# EAGLE design geiger (EAGLE 6.4)
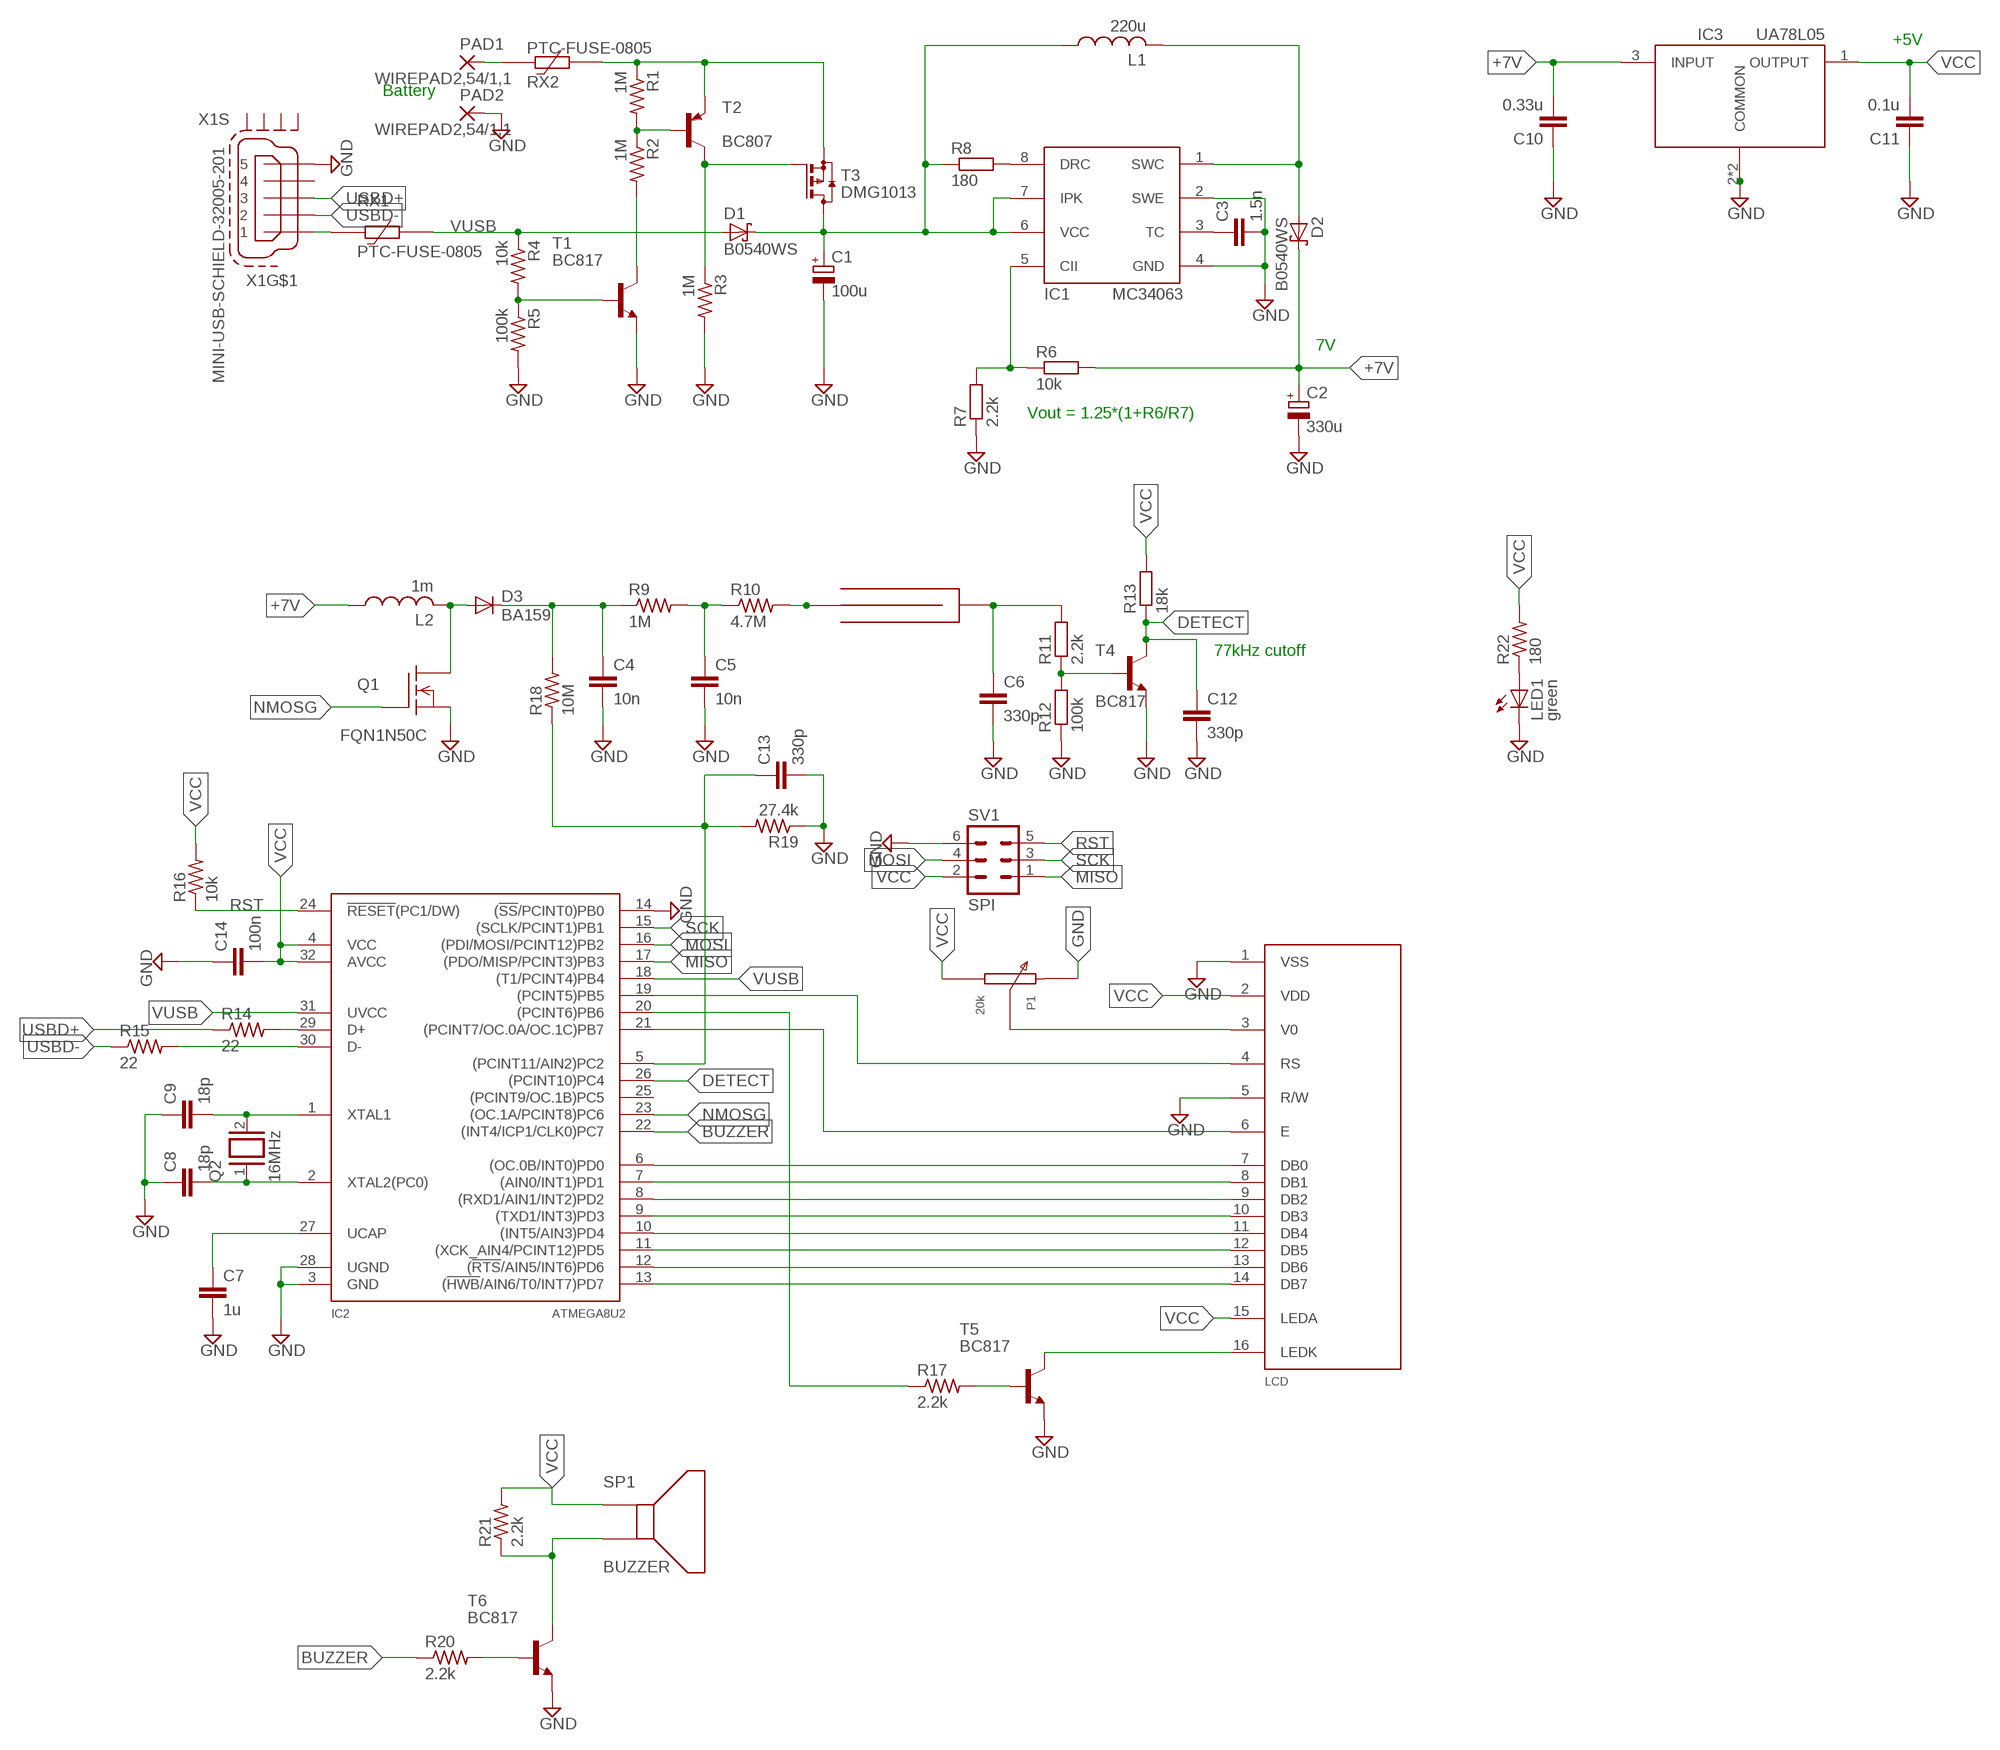
[diagram p0: schematic, sheet 1]

## Parts
C1  100u  CPOL-EUE2.5-6  [E2,5-6]
C2  330u  CPOL-EUE2.5-6  [E2,5-6]
C3  1.5n  C-EUC0603  [C0603]
C4  10n  C-EU050-024X044  [C050-024X044]
C5  10n  C-EU050-024X044  [C050-024X044]
C6  330p  C-EUC0603  [C0603]
C7  1u  C-EUC0603  [C0603]
C8  18p  C-EUC0603  [C0603]
C9  18p  C-EUC0603  [C0603]
C10  0.33u  C-EUC0603  [C0603]
C11  0.1u  C-EUC0603  [C0603]
C12  330p  C-EUC0603  [C0603]
C13  330p  C-EUC0603  [C0603]
C14  100n  C-EUC0603  [C0603]
D1  B0540WS  [SOD323-R]
D2  B0540WS  [SOD323-R]
D3  BA159  [DO41-10]
G1  CI-22BG/SI-3BG  [FUSE102074]
IC1  MC34063  [SO8]
IC2  ATMEGA8U2  [TQFP32-08]
IC3  UA78L05  [SOT89]
L1  220u  BOURNS8012  [L8012]
L2  1m  BOURNS8012  [L8012]
LCD  TAYDA-LCD  [LCD-PINOUT]
LED1  green  LEDCHIP-LED0603  [CHIP-LED0603]
P1  20k  TRIMPOT  [TRIMPOT]
PAD1  WIREPAD2,54/1,1  [2,54/1,1]
PAD2  WIREPAD2,54/1,1  [2,54/1,1]
Q1  FQN1N50C  [TO92]
Q2  16MHz  XTAL/S  [QS]
R1  1M  R-US_R0603  [R0603]
R2  1M  R-US_R0603  [R0603]
R3  1M  R-US_R0603  [R0603]
R4  10k  R-US_R0603  [R0603]
R5  100k  R-US_R0603  [R0603]
R6  10k  R-EU_R0603  [R0603]
R7  2.2k  R-EU_R0603  [R0603]
R8  180  R-EU_R0603  [R0603]
R9  1M  R-US_0207/7  [0207/7]
R10  4.7M  R-US_0207/7  [0207/7]
R11  2.2k  R-EU_R0603  [R0603]
R12  100k  R-EU_R0603  [R0603]
R13  18k  R-EU_R0603  [R0603]
R14  22  R-US_R0603  [R0603]
R15  22  R-US_R0603  [R0603]
R16  10k  R-US_R0603  [R0603]
R17  2.2k  R-US_R0603  [R0603]
R18  10M  R-US_0207/7  [0207/7]
R19  27.4k  R-US_R0603  [R0603]
R20  2.2k  R-US_R0603  [R0603]
R21  2.2k  R-US_R0603  [R0603]
R22  180  R-US_R0603  [R0603]
RX1  PTC-FUSE-0805  [R0805]
RX2  PTC-FUSE-0805  [R0805]
SP1  BUZZER  [BUZZER]
SV1  SPI  MA03-2  [MA03-2]
T1  BC817  BC817-40-NPN-SOT23-BEC  [SOT23-BEC]
T2  BC807  BC807-40-PNP-SOT23-BEC  [SOT23-BEC]
T3  DMG1013  [SOT323]
T4  BC817  BC817-40-NPN-SOT23-BEC  [SOT23-BEC]
T5  BC817  BC817-40-NPN-SOT23-BEC  [SOT23-BEC]
T6  BC817  BC817-40-NPN-SOT23-BEC  [SOT23-BEC]
X1  MINI-USB-SCHIELD-32005-201  [32005-201]

## Nets
+7V: C2.+ C10.2 D2.C IC3.3(INPUT) L2.1 R6.2
BUZZER: IC2.22((INT4/ICP1/CLK0)PC7) R20.1
DETECT: C12.1 IC2.26((PCINT10)PC4) R13.1 T4.C
GND: C1.- C2.- C3.2 C4.2 C5.2 C6.2 C7.2 C8.1 C9.1 C10.1 C11.1 C12.2 C13.2 C14.1 IC1.2(SWE) IC1.4(GND) IC2.3(GND) IC2.14((!SS!/PCINT0)PB0) IC2.28(UGND) IC3.2(COMMON) IC3.2@1(COMMON) LCD.1(VSS) LCD.5(R/W) LED1.C P1.P$2 PAD2.1(P) Q1.1(S) R3.2 R5.2 R7.1 R12.1 R19.1 SV1.6 T1.E T4.E T5.E T6.E X1.5
MISO: IC2.17((PDO/MISP/PCINT3)PB3) SV1.1
MOSI: IC2.16((PDI/MOSI/PCINT12)PB2) SV1.4
N$1: R1.2 R2.1 T2.B
N$2: R2.2 T1.C
N$3: R3.1 T2.C T3.2(G)
N$4: R1.1 RX2.2 T2.E T3.3(S)
N$5: R4.2 R5.1 T1.B
N$6: D3.A L2.2 Q1.2(D)
N$7: C1.+ D1.C IC1.6(VCC) IC1.7(IPK) L1.1 R8.1 T3.1(D)
N$8: IC1.5(CII) R6.1 R7.2
N$9: C4.1 D3.C R9.1 R18.2
N$10: C5.1 R9.2 R10.1
N$11: IC1.8(DRC) R8.2
N$12: D2.A IC1.1(SWC) L1.2
N$13: G1.A1(A) G1.A2(A) R10.2
N$14: C3.1 IC1.3(TC)
N$15: R11.1 R12.2 T4.B
N$16: C6.1 G1.C1(C) G1.C2(C) G1.C3(C) G1.C4(C) R11.2
N$17: IC2.29(D+) R14.2
N$18: IC2.30(D-) R15.2
N$19: R21.1 SP1.P$2 T6.C
N$20: RX1.1 X1.1
N$21: C7.1 IC2.27(UCAP)
N$22: IC2.6((OC.0B/INT0)PD0) LCD.7(DB0)
N$23: C9.2 IC2.1(XTAL1) Q2.2
N$24: C8.2 IC2.2(XTAL2(PC0)) Q2.1
N$25: IC2.7((AIN0/INT1)PD1) LCD.8(DB1)
N$26: IC2.8((RXD1/AIN1/INT2)PD2) LCD.9(DB2)
N$27: IC2.9((TXD1/INT3)PD3) LCD.10(DB3)
N$28: IC2.10((INT5/AIN3)PD4) LCD.11(DB4)
N$29: IC2.11((XCK_AIN4/PCINT12)PD5) LCD.12(DB5)
N$30: IC2.12((!RTS!/AIN5/INT6)PD6) LCD.13(DB6)
N$31: IC2.13((!HWB!/AIN6/T0/INT7)PD7) LCD.14(DB7)
N$32: IC2.21((PCINT7/OC.0A/OC.1C)PB7) LCD.6(E)
N$33: PAD1.1(P) RX2.1
N$34: IC2.19((PCINT5)PB5) LCD.4(RS)
N$35: LCD.3(V0) P1.P$1(WIPER)
N$36: LCD.16(LEDK) T5.C
N$37: R17.2 T5.B
N$38: IC2.20((PCINT6)PB6) R17.1
N$39: C13.1 IC2.5((PCINT11/AIN2)PC2) R18.1 R19.2
N$40: R20.2 T6.B
N$41: LED1.A R22.1
NMOSG: IC2.23((OC.1A/PCINT8)PC6) Q1.3(G)
RST: IC2.24(!RESET!(PC1/DW)) R16.1 SV1.5
SCK: IC2.15((SCLK/PCINT1)PB1) SV1.3
USBD+: R14.1 X1.3
USBD-: R15.1 X1.2
VCC: C11.2 C14.2 IC2.4(VCC) IC2.32(AVCC) IC3.1(OUTPUT) LCD.2(VDD) LCD.15(LEDA) P1.P$3 R13.2 R16.2 R21.2 R22.2 SP1.P$1 SV1.2
VUSB: D1.A IC2.18((T1/PCINT4)PB4) IC2.31(UVCC) R4.1 RX1.2
Unconnected: IC2.25((PCINT9/OC.1B)PC5) X1.4 X1.M1(S:S1) X1.M2(S:S2) X1.M3(S:S3) X1.M4(S:S4)

## Notes on the sheet
- +5V
- Battery
- 7V
- Vout = 1.25*(1+R6/R7)
- 77kHz cutoff

## Library data of the parts
C1 C2 = rcl:CPOL-EU: POLARIZED CAPACITOR, European symbol
C3-C14 = rcl:C-EU: CAPACITOR, European symbol
D1 D2 = hf:B0540WS
D3 = hf:BA159: DIODE fast soft-recovery controlled avalanche rectifier
G1 = hf:CI-22BG/SI-3BG
IC1 = hf:MC34063
IC2 = hf:ATMEGA8U2: Atmel ATMEGA8U2 microprocessor in TQFP32 package
IC3 = hf:UA78L05
L1 L2 = hf:BOURNS8012
LCD = hf:TAYDA-LCD
LED1 = led:LED: LED OSRAM: - CHIPLED LG R971, LG N971, LY N971, LG Q971, LY Q971, LO R971, LY R971 LH N974, LH R974 LS Q976, LO Q976, LY Q976 LO Q996 - Hyper CHIPLED LW Q18S LB Q993, LB Q99A, LB R99A - SideLED LS A670, LO A670, LY A670, LG A670, LP A670 LB A673, LV A673, LT A673, LW A673 LH A674 LY A675 LS A676, LA A676, LO A676, LY A676, LW A676 LS A679, LY A679, LG A679 - Hyper Micro SIDELED® LS Y876, LA Y876, LO Y876, LY Y876 LT Y87S - SmartLED LW L88C, LW L88S LB L89C, LB L89S, LG L890 LS L89K, LO L89K, LY L89K LS L896, LA L896, LO L896, LY L896 - TOPLED LS T670, LO T670, LY T670, LG T670, LP T670 LSG T670, LSP T670, LSY T670, LOP T670, LYG T670 LG T671, LOG T671, LSG T671 LB T673, LV T673, LT T673, LW T673 LH T674 LS T676, LA T676, LO T676, LY T676, LB T676, LH T676, LSB T676, LW T676 LB T67C, LV T67C, LT T67C, LS T67K, LO T67K, LY T67K, LW E67C LS E67B, LA E67B, LO E67B, LY E67B, LB E67C, LV E67C, LT E67C LW T67C LS T679, LY T679, LG T679 LS T770, LO T770, LY T770, LG T770, LP T770 LB T773, LV T773, LT T773, LW T773 LH T774 LS E675, LA E675, LY E675, LS T675 LS T776, LA T776, LO T776, LY T776, LB T776 LHGB T686 LT T68C, LB T68C - Hyper Mini TOPLED® LB M676 - Mini TOPLED Santana® LG M470 LS M47K, LO M47K, LY M47K Source: http://www.osram.convergy.de LUXEON: - LUMILED® LXK2-PW12-R00, LXK2-PW12-S00, LXK2-PW14-U00, LXK2-PW14-V00 LXK2-PM12-R00, LXK2-PM12-S00, LXK2-PM14-U00 LXK2-PE12-Q00, LXK2-PE12-R00, LXK2-PE12-S00, LXK2-PE14-T00, LXK2-PE14-U00 LXK2-PB12-K00, LXK2-PB12-L00, LXK2-PB12-M00, LXK2-PB14-N00, LXK2-PB14-P00, LXK2-PB14-Q00 LXK2-PR12-L00, LXK2-PR12-M00, LXK2-PR14-Q00, LXK2-PR14-R00 LXK2-PD12-Q00, LXK2-PD12-R00, LXK2-PD12-S00 LXK2-PH12-R00, LXK2-PH12-S00 LXK2-PL12-P00, LXK2-PL12-Q00, LXK2-PL12-R00 Source: www.luxeon.com KINGBRIGHT: KA-3528ASYC Source: www.kingbright.com
P1 = hf:TRIMPOT
PAD1 PAD2 = wirepad:WIREPAD: Wire PAD connect wire on PCB
Q1 = hf:FQN1N50C: N-Channel Enhancement MOSFET not checked
Q2 = hf:XTAL/S: CRYSTAL
R1-R5 R14-R17 R19-R22 = resistor:R-US_: RESISTOR, American symbol
R6-R8 R11-R13 = resistor:R-EU_: RESISTOR, European symbol
R9 R10 R18 = rcl:R-US_: RESISTOR, American symbol
RX1 RX2 = hf:PTC-FUSE-0805: PTC Dummy
SP1 = hf:BUZZER
SV1 = con-lstb:MA03-2: PIN HEADER; OC_FARNELL: unknown; OC_NEWARK: unknown
T1 T4-T6 = transistor:*-NPN-: NPN Transistror BF959 corrected 2008.03.06
T2 = transistor:*-PNP-: PNP Transistror
T3 = hf:DMG1013
X1 = hf:MINI-USB-SCHIELD-: MINI USB-B Conector Source: www.cypressindustries.com; OC_FARNELL: unknown; OC_NEWARK: unknown

## Board
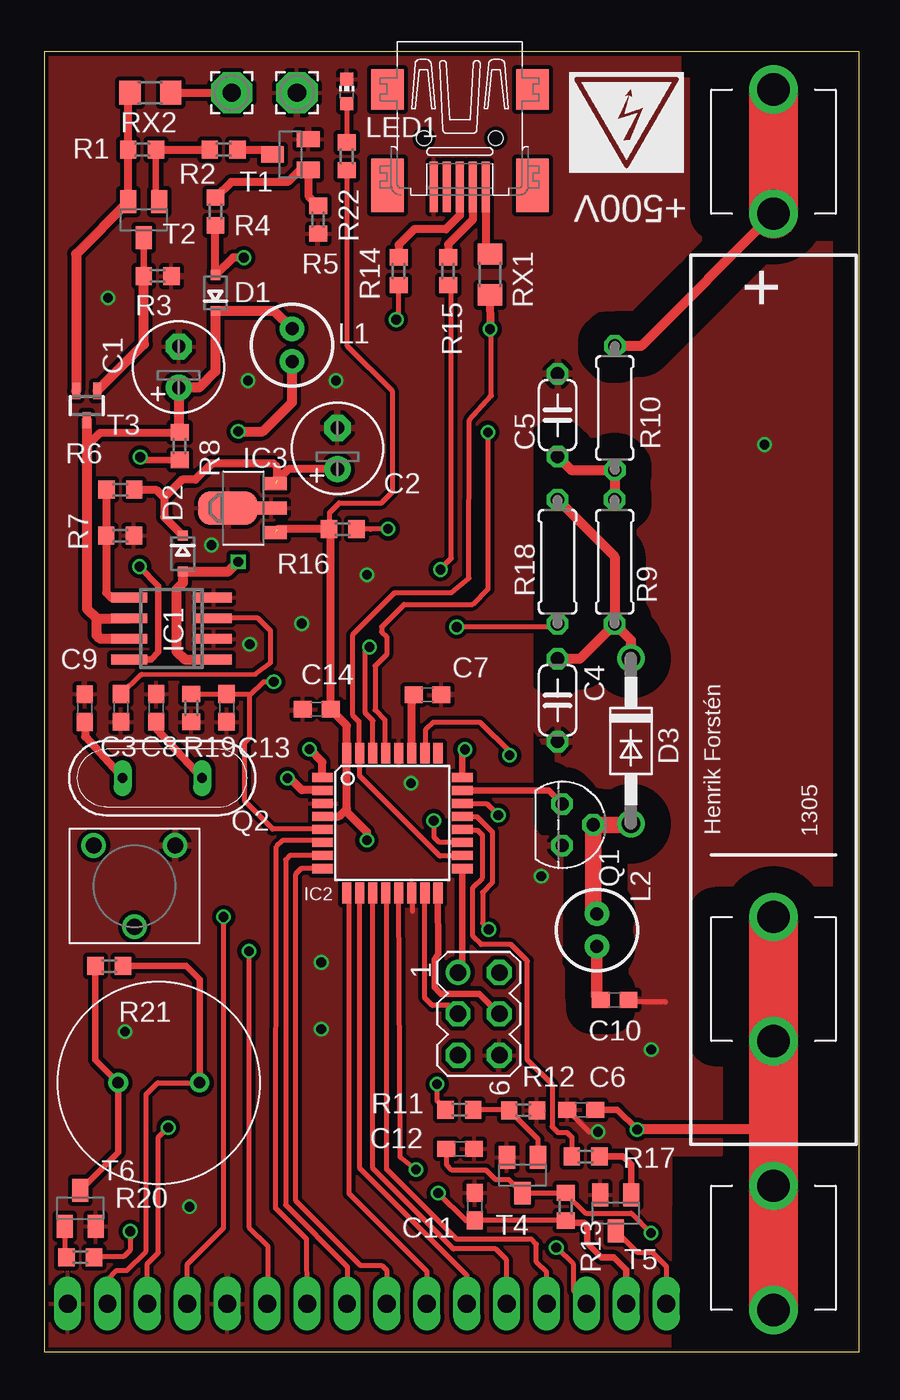
[diagram p1: board, top side]
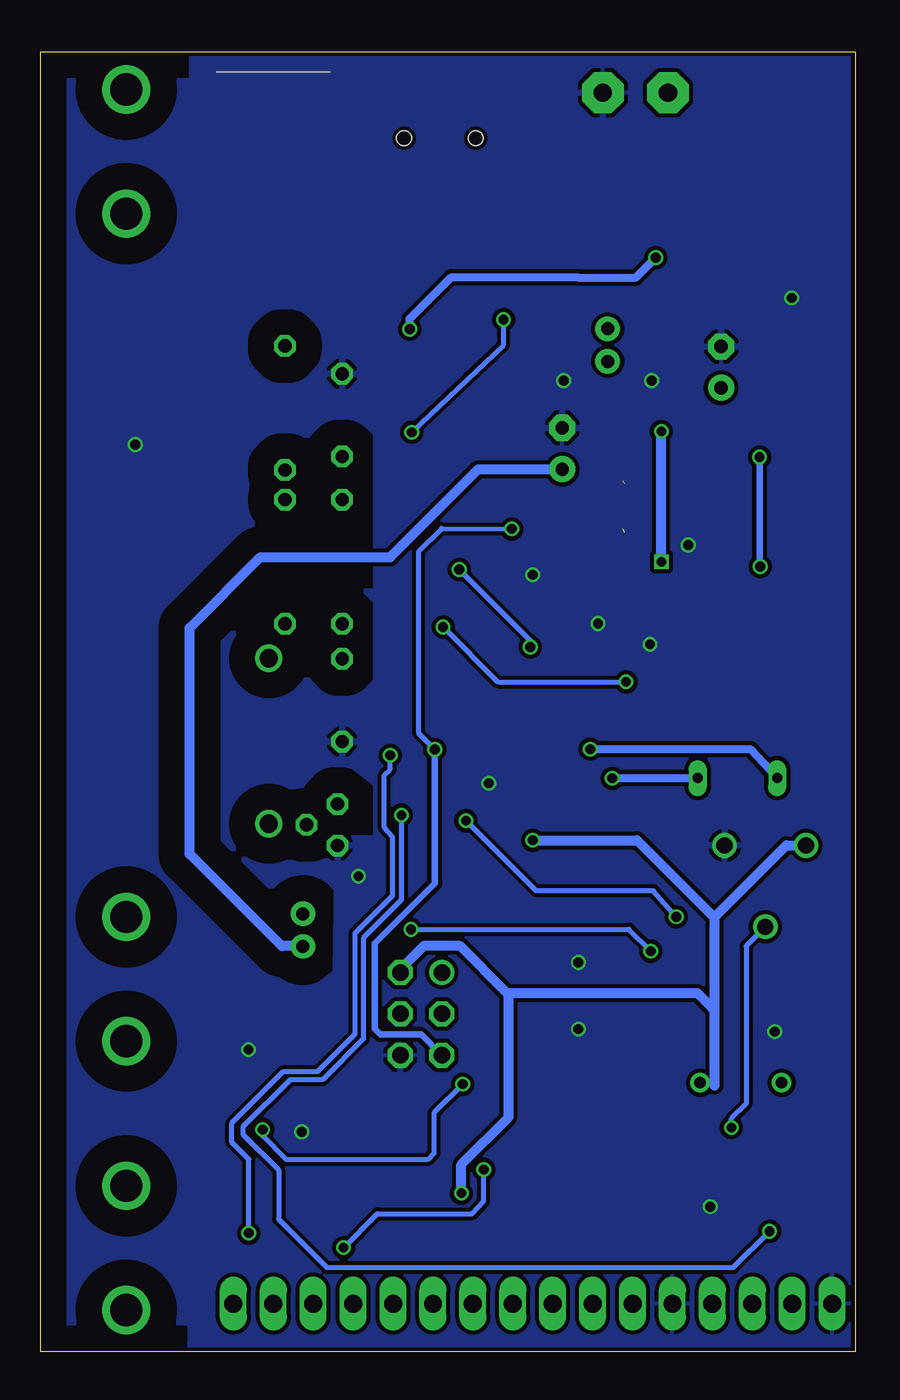
[diagram p2: board, bottom side, seen from below]

Size 50 x 79.8 mm. Coordinates in mm from the lower left corner, seen from the top.
Outline: 0,0 50,0 50,79.8 0,79.8 0,0
Copper layers (1*16): Top 0.035mm / dielectric 1.5mm / Bottom 0.035mm
Design rules "ITEADstudio_DRC": minimum track width 6mil, minimum drill 12mil, track to track 6mil, track to pad 6mil, pad to pad 6mil, via to via 6mil, smd to smd 0mil, copper to edge 10mil, drill to drill 10mil, minimum pad ring 10mil, minimum via ring 6mil, stop-mask expansion 2mil, vias tented up to drill 100mil, thermal gap 10mil
tRestrict: area 41,2.4 to 48.5,10.4; area 41.2,19.1 to 48.5,26.9; area 41.2,69.8 to 48.5,77.7

### Footprints (pad centres in the part's own frame; a part is rotated, then mirrored left to right if it is on the bottom)
E2,5-6 = drill 0.813 pad 1.6: + -1.27,0 | drill 0.813 pad 1.6 octagon: - 1.27,0
C0603 = smd 1.1 x 1: 1 -0.85,0; 2 0.85,0
C050-024X044 = drill 0.813 octagon: 1 -2.54,0; 2 2.54,0
SOD323-R = smd 0.6 x 0.6: A 1.1,0; C -1.1,0
DO41-10 = drill 1.118: A 5.08,0; C -5.08,0
FUSE102074 = drill 1.981: A1 -3.81,0; A2 3.81,0; C1 46.99,0; C2 54.61,0; C3 63.5,0; C4 71.12,0
SO8 = smd 0.6 x 2.2: 1 -1.905,-2.6; 2 -0.635,-2.6; 3 0.635,-2.6; 4 1.905,-2.6; 5 1.905,2.6; 6 0.635,2.6; 7 -0.635,2.6; 8 -1.905,2.6
TQFP32-08 = smd 1.27 x 0.559: 1 -4.293,2.8; 2 -4.293,2; 3 -4.293,1.2; 4 -4.293,0.4; 5 -4.293,-0.4; 6 -4.293,-1.2; 7 -4.293,-2; 8 -4.293,-2.8; 17 4.293,-2.8; 18 4.293,-2; 19 4.293,-1.2; 20 4.293,-0.4; 21 4.293,0.4; 22 4.293,1.2; 23 4.293,2; 24 4.293,2.8 | smd 0.559 x 1.27: 9 -2.8,-4.293; 10 -2,-4.293; 11 -1.2,-4.293; 12 -0.4,-4.293; 13 0.4,-4.293; 14 1.2,-4.293; 15 2,-4.293; 16 2.8,-4.293; 25 2.8,4.293; 26 2,4.293; 27 1.2,4.293; 28 0.4,4.293; 29 -0.4,4.293; 30 -1.2,4.293; 31 -2,4.293; 32 -2.8,4.293
SOT89 = smd 0.8 x 1.4: 1 -1.499,-1.981; 3 1.499,-1.981 | smd 0.8 x 1.9: 2 0,-1.727 | smd 2.032 x 3.65: 2@1 0,0.94
L8012 = drill 0.8 pad 1.5: 1 -1,0; 2 1,0
LCD-PINOUT = drill 1.1 long: 1 -2.575,-0.05; 2 -0.125,-0.05; 3 2.325,-0.05; 4 4.775,-0.05; 5 7.225,-0.05; 6 9.675,-0.05; 7 12.125,-0.05; 8 14.575,-0.05; 9 17.025,-0.05; 10 19.475,-0.05; 11 21.925,-0.05; 12 24.375,-0.05; 13 26.825,-0.05; 14 29.275,-0.05; 15 31.725,-0.05; 16 34.175,-0.05
CHIP-LED0603 = smd 0.8 x 0.8: A 0,-0.75; C 0,0.75
TRIMPOT = drill 1: P$1 0,2; P$2 -2.5,-3; P$3 2.5,-3
2,54/1,1 = drill 1.118 pad 2.54 octagon: 1 0,0
TO92 = drill 0.813 octagon: 1 1.27,0; 2 0,1.905; 3 -1.27,0
QS = drill 0.61 long: 1 -2.44,0; 2 2.44,0
R0603 = smd 1 x 1.1: 1 -0.85,0; 2 0.85,0
0207/7 = drill 0.813 octagon: 1 -3.81,0; 2 3.81,0
R0805 = smd 1.3 x 1.5: 1 -1.25,0; 2 1.25,0
BUZZER = drill 0.7: P$1 -2.5,0; P$2 2.5,0
MA03-2 = drill 1.016: 1 -2.54,-1.27 | drill 1.016 octagon: 2 -2.54,1.27; 3 0,-1.27; 4 0,1.27; 5 2.54,-1.27; 6 2.54,1.27
SOT23-BEC = smd 1 x 1.4: B -0.95,-1.1; C 0,1.1; E 0.95,-1.1
SOT323 = smd 0.5 x 1: 1 0,0.9; 2 -0.65,-0.9; 3 0.65,-0.9
32005-201 = smd 3.1 x 0.5: 1 3,1.6; 2 3,0.8; 3 3,0; 4 3,-0.8; 5 3,-1.6 | smd 2.5 x 2: M1 -3,-4.45; M2 -3,4.45 | smd 3.3 x 2: M3 2.9,4.45; M4 2.9,-4.45 | hole 0.9: 0,2.2; 0,-2.2

### Placement (x,y rotation side)
C1  8.24,60.45 90 top
C2  17.99,55.45 90 top
C3  4.7,39.53 270 top
C4  31.5,40 270 top
C5  31.5,57.5 90 top
C6  32.95,14.85 180 top
C7  23.52,40.33 0 top
C8  6.86,39.53 270 top
C9  2.48,39.52 270 top
C10  35,21.6 180 top
C11  26.42,8.9 270 top
C12  25.52,12.45 0 top
C13  11.18,39.53 270 top
C14  16.71,39.44 0 top
D1  10.5,65 90 top
D2  8.5,49 270 top
D3  36,37.5 270 top
G1  44.75,73.68 270 top
IC1  7.8,44.4 90 top
IC2  21.36,32.46 0 top
IC3  12.2,51.8 90 top
L1  15.2,61.8 270 top
L2  33.91,25.88 90 top
LCD  4,3 0 top
LED1  18.56,77.38 0 top
P1  5.53,28.08 180 top
PAD1  11.5,77.3 0 top
PAD2  15.5,77.3 90 top
Q1  31.78,32.35 270 top
Q2  7.24,35.22 180 top
R1  6,73.8 0 top
R2  11,73.8 0 top
R3  6.95,66.04 0 top
R4  10.5,70 90 top
R5  16.8,69.5 270 top
R6  4.67,52.92 0 top
R7  4.65,50.1 180 top
R8  8.3,55.6 270 top
R9  35,48.5 90 top
R10  35.01,57.94 90 top
R11  25.47,14.85 180 top
R12  29.38,14.83 180 top
R13  32,8.9 270 top
R14  21.74,66.33 270 top
R15  24.78,66.33 270 top
R16  18.31,50.5 180 top
R17  33.22,11.98 0 top
R18  31.5,48.5 90 top
R19  9.01,39.53 90 top
R20  2.2,5.8 180 top
R21  3.98,23.68 0 top
R22  18.56,73.4 270 top
RX1  27.35,66.13 270 top
RX2  6.5,77.3 180 top
SP1  7.03,16.52 180 top
SV1  26.65,20.74 270 top
T1  15.1,73.5 90 top
T2  6.1,69.5 180 top
T3  2.6,58.1 180 top
T4  29.34,10.83 180 top
T5  35.06,8.52 180 top
T6  2.2,8.8 0 top
X1  25.5,74.5 270 top

### Tracks (layer width: path | path; a pad name or v marks a point on that pad's centre or on a via)
+7V  (1 unrouted)
  Top 0.5: R6.2 6.86,52.92 7.34,52.43 | 7.34,52.43 7.34,51.26 D2.C | C2.+ 14.96,54.18 14.28,53.5 14.28,54.31 14.05,54.53 10.26,54.53 9.27,53.54 8.45,53.54 7.34,52.43
  Top 0.7: L2.1 33.91,21.84 C10.2
  Bottom 0.6: C2.+ 23.14,54.18 28.54,48.78 36.52,48.78 40.86,44.44 40.86,30.56 35.2,24.9 33.93,24.9 L2.1
BUZZER  (via drill 0.6)
  Top 0.3: IC2.22 27.15,33.66 v27.86,32.94 | v5.27,7.39 5.27,6.22 4.87,5.83 3.08,5.83 R20.1
  Bottom 0.3: v5.27,7.39 7.48,5.17 32.44,5.17 35.4,8.13 35.4,11.16 37.6,13.36 37.6,13.8 34.7,16.7 32.7,16.7 30.2,19.2 30.2,25.4 27.86,27.74 v27.86,32.94
DETECT  (via drill 0.6)
  Top 0.3: C12.1 24.68,12.44 24.68,11.48 25.02,11.15 27.11,11.15 27.7,10.55 28.52,10.55 T4.C 29.36,9.75 R13.1 31.98,9.73 33.22,8.5 36.01,8.5 v37.23,7.28 | IC2.26 23.41,36.8 23.41,38.22 23.85,38.66 26.73,38.66 28.55,36.84 v28.55,36.62
  Bottom 0.3: 28.75,36.41 v28.55,36.62 28.55,35.75 28.9,35.4 28.9,32.2 28.4,31.6 28.4,28 30.7,25.7 30.7,19.5 33,17.2 35.1,17.2 38.27,14.03 38.27,12.85 37.23,11.81 v37.23,7.28
GND  (via drill 0.6)
  Top 0.3: 38.13,21.46 35.99,21.46 C10.1 | C6.2 33.46,13.49 v33.98,13.49 | IC2.14 22.59,28.14 22.59,27.03
  Bottom 0.3: v33.98,13.49 34.1,13.38 34.15,13.38
  other vias: 12.61,43.43 37.25,18.54 17,23.9 17,19.8 15.8,44.7 19.8,47.7 22.5,34.9 44.2,55.7 8.9,8.9 30.5,29.2 4.95,19.64 10.25,49.53 12.5,59.62 3.9,64.7 17.9,59.62
  pour Top (isolate 0.254): -4.2,81.3 36.73,81.37 39.04,81.35 38.91,66.85 35.7,64 30.9,63.8 29.9,60.4 29.9,32.3 30.4,31.6 31.8,31.6 31.75,29.27 31.67,19.55 37.11,15.65 41.55,15.62 41.55,12.07 38.44,12.08 38.4,-0.56 38.41,-1.17 38.36,-1.44 -4.2,-1
  pour Top (isolate 1.6, rank 2): 52.2,80.5 35.4,80.5 32.4,83 18.3,84.5 -9.2,85.3 -10.5,65.5 -10.9,49.7 -9.9,28.5 -9.3,-2.1 38.9,-1.5 52,-1.5 52.1,-1.4 52.1,80.4
  pour Bottom (isolate 0.254): -4.2,81.3 36,81.2 40.8,81.5 40.8,67.8 36,67.9 29.5,60.6 29.5,40.8 32.6,39.11 33.6,38 29.5,34.8 29.5,31.7 29.4,31.6 31.8,31.6 31.9,29.2 31.99,23.35 38.9,17.9 40.5,17.9 40.5,14 40.8,14.1 40.9,-1.4 40.2,-1.4 -4.2,-1
  pour Bottom (isolate 1.6, rank 2): 52.7,80.4 35.9,80.4 32.9,82.9 18.8,84.4 -8.7,85.2 -10,65.4 -10.4,49.6 -9.4,28.4 -8.8,-2.2 39.4,-1.6 52.5,-1.6 52.6,-1.5 52.6,80.3
MISO
  Top 0.4: SV1.1 25.65,23.55 IC2.17
MOSI
  Top 0.4: SV1.4 26.7,21.97 24.34,21.97 23.95,22.36 23.95,24.07 24.17,24.43 IC2.16
N$1
  Top 0.4: R1.2 6.85,70.8 T2.B
  Top 0.5: R1.2 R2.1
N$2
  Top 0.5: R2.2 13.7,73.8 T1.C
N$3
  Top 0.4: T2.C R3.1
  Top 0.6: T3.2 6.1,61.85 R3.1
N$4
  Top 0.5: T2.E R1.1 5.15,77.2 RX2.2
  Top 0.6: T2.E 1.95,67.4 T3.3
N$5
  Top 0.5: R5.1 16.2,70.95 T1.B 15.67,72.55 14.94,71.82 11.47,71.82 R4.2
N$6
  Top 0.7: 35.93,32.35 D3.A | 33.69,27.11 L2.2
  Top 1: 35.93,32.35 Q1.2 33.69,27.11
N$7
  Top 0.5: 8.25,56.4 3.4,56.4 2.6,55.6
  Top 0.6: T3.1 2.6,55.6 2.6,45.6 3.2,45 | 3.2,45 5.17,45 IC1.6 | IC1.7 3.44,43.77 3.2,44 3.2,45 | 8.25,56.4 R8.1 8.24,56.51 C1.+ 8.26,59.2 9.5,59.2 10.5,60.2 D1.C 14.1,63.9 L1.1
N$8
  Top 0.5: R6.1 3.8,52.9 R7.2 3.8,46.6 4.1,46.3 IC1.5
N$9
  Top 0.6: R18.2 35,48.81 R9.1 | R9.1 36,43.69 D3.C | R9.1 32.85,42.54 C4.1
N$10
  Top 0.6: C5.1 32.33,54.13 R10.1 R9.2
N$11  (via drill 0.6)
  Top 0.4: IC1.8 5.21,42.51 6.56,42.51 7,42.95 7,47 5.84,48.16 v5.84,48.21 | v5.88,54.92 6.05,54.75 R8.2
  Bottom 0.4: v5.84,48.21 5.88,48.25 v5.88,54.92
N$12  (via drill 0.6)
  Top 0.4: IC1.1 10.39,42.51 | 8.5,47.44 D2.A
  Top 0.6: 8.5,47.44 8.5,47.2 8.1,46.8 8.1,43 8.6,42.5 IC1.1 | D2.A 11.3,47.9 v11.9,48.5 | v11.9,56.5 13.4,56.5 15.2,58.3 L1.2
  Bottom 0.6: v11.9,48.5 v11.9,56.5
N$13
  Top 0.6: G1.A2 36.63,61.75 R10.2
  Top 3: G1.A1 G1.A2
N$14
  Top 0.3: C3.1 5.92,41.57 5.99,41.57 6,41.58 12.96,41.6 13.88,42.31 13.88,44.25 13.1,45.03 IC1.3
N$15
  Top 0.3: 30.28,11.94 T4.B | 30.29,12.17 T4.B | R11.1 28.5,14.85 R12.2 30.29,13.06 T4.B
N$16  (via drill 0.6)
  Top 0.3: R11.2 24.64,14.84 24.65,14.84 24.1,15.39 v24.1,16.42
  Top 0.4: C6.1 35.17,14.85 v36.38,13.63
  Top 0.6: G1.C3 44.75,13.5 44.62,13.63 v36.38,13.63
  Top 3: G1.C1 G1.C2 G1.C3 G1.C4
  Bottom 0.3: v24.1,16.42 25.87,14.66 25.87,12.17 26.26,11.78 34.92,11.78 36.38,13.25 v36.38,13.63
N$17  (via drill 0.6)
  Top 0.3: IC2.29 21.09,36.88 | v21.59,63.37 21.74,63.51 R14.2 | 20.9,37.01 IC2.29 | IC2.29 20.9,36.81 20.9,38.8 20.3,39.4 20.3,42.1 21,42.8 21,43.9 20.7,44.2 20.7,44.5 22.08,45.88 26.29,45.88 27.22,46.81 v27.22,56.45
  Bottom 0.3: v27.22,56.45 21.59,61.8 v21.59,63.37
N$18  (via drill 0.6)
  Top 0.3: v24.31,48.02 24.31,48.04 24.98,48.72 24.98,65.28 R15.2 | IC2.30 20.16,38.74 19.7,39.2 19.7,43.01 v19.95,43.26
  Bottom 0.3: v19.95,43.26 19.95,43.67 v24.31,48.02
N$19
  Top 0.4: R21.1 3.13,17.92 SP1.P$2 4.53,12.23 T6.C
N$20
  Top 0.5: X1.1 27.1,67.38 RX1.1
N$21
  Top 0.5: IC2.27 22.56,39.82 C7.1
N$22
  Top 0.3: LCD.7 16.1,6.9 14.2,8.8 14.24,31 14.63,31.4 16.92,31.4 IC2.6
N$23  (via drill 0.6)
  Top 0.5: IC2.1 17.07,36.2 v16.27,36.99 | C9.2 2.5,37.76 Q2.2
  Bottom 0.5: v16.27,36.99 6.45,36.99 Q2.2
N$24  (via drill 0.6)
  Top 0.3: 6.9,38.24 C8.2
  Top 0.5: Q2.1 6.9,38.24 | IC2.2 17.04,34.49 15.8,34.49 15.08,35.21 v14.92,35.21
  Bottom 0.5: v14.92,35.21 14.91,35.22 Q2.1
N$25
  Top 0.3: IC2.7 15.06,30.46 14.8,30.2 14.8,9 18.6,5.2 18.6,2.98 LCD.8
N$26
  Top 0.3: IC2.8 15.76,29.66 15.4,29.3 15.4,9.3 19.4,5.3 20.7,5.3 21,5 21,2.98 LCD.9
N$27
  Top 0.3: IC2.9 18.68,28.04 18.68,9.71 23.48,4.92 LCD.10
N$28
  Top 0.3: LCD.11 25.93,4.67 19.36,11.24 IC2.10
N$29
  Top 0.3: LCD.12 28.38,5.62 27.7,6.3 25.1,6.3 20.16,11.24 IC2.11
N$30
  Top 0.3: LCD.13 30.82,4.88 30.2,5.5 30.2,6.6 29.9,6.9 25.3,6.9 21,11.2 21,28.12 IC2.12
N$31  (via drill 0.6)
  Top 0.3: LCD.14 32.48,3.75 32.48,5.35 31.45,6.39 v31.41,6.39 | v22.81,11.18 21.83,11.94 IC2.13
  Bottom 0.3: v31.41,6.39 29.34,8.46 23.51,8.46 22.81,9.24 v22.81,11.18
N$32  (via drill 0.6)
  Top 0.3: v12.56,24.59 12.56,7.64 13.7,6.5 13.7,2.98 LCD.6 | IC2.21 26.54,32.86 27.5,31.9 27.5,28.8 26.9,28.2 26.9,26.31 v27.28,25.93
  Bottom 0.3: v27.28,25.93 13.9,25.93 v12.56,24.59
N$33
  Top 0.5: RX2.1 PAD1.1
N$34  (via drill 0.6)
  Top 0.3: LCD.4 8.78,5.38 11,7.6 v11,26.7 | v23.9,32.6 23.9,31.6 24.2,31.3 25.61,31.3 IC2.19
  Bottom 0.3: v11,26.7 12.4,28.3 19.6,28.3 v23.9,32.6
N$35  (via drill 0.6)
  Top 0.3: LCD.3 6.33,5.4 7,6.07 7,13.16 v7.6,13.76
  Bottom 0.3: v7.6,13.76 7.6,14.32 6.7,15.23 6.7,24.91 P1.P$1 5.52,26.28
N$36
  Top 0.3: T5.C 36.39,6.1 37.3,6.1 38.17,5.22 LCD.16
N$37
  Top 0.4: T5.B 36.02,11.49 35.51,12 34.08,12 R17.2
N$38
  Top 0.3: R17.1 32.37,12.33 | 25.74,31.96 IC2.20 25.71,32 26.6,32 26.9,31.7 26.9,29.1 26.3,28.5 26.3,25.5 26.8,25 28.63,25 29.65,23.98 29.65,17.91 31.19,16.37 31.17,16.35 31.17,13.82 31.52,13.46 32.07,13.46 32.37,13.17 R17.1 | 32.37,12.24 R17.1
N$39  (via drill 0.6)
  Top 0.3: IC2.5 17.03,32.09 14.01,32.09 12.3,33.8 12.3,37.4 12.6,37.7 12.6,40.28 | R18.1 31.31,44.5 v25.31,44.5 | v14.07,41.13 13.45,41.13 12.6,40.28 | R19.2 C13.1 12.5,40.38 12.6,40.28
  Bottom 0.3: v25.31,44.5 21.94,41.13 v14.07,41.13
N$40
  Top 0.3: T6.B 1.25,5.9 R20.2
N$41
  Top 0.3: LED1.A R22.1
NMOSG
  Top 0.4: Q1.3 30.94,34.46 IC2.23
RST  (via drill 0.6)
  Top 0.3: v21.1,50.52 20,50.5 R16.1
  Top 0.4: v25.81,36.97 25.65,36.81 IC2.24
  Bottom 0.3: v25.81,36.97 26.79,37.95 26.79,49.15 25.39,50.55 v21.1,50.52
  Bottom 0.4: SV1.5 26.65,19.47 29.16,19.47 29.5,19.8 29.5,25.06 25.81,28.74 v25.81,36.97
SCK
  Top 0.3: SV1.3 24.87,21.26 23.81,21.26 23.36,21.71 IC2.15
USBD+
  Top 0.5: X1.3 25.5,69.77 24.64,68.91 22.69,68.91 21.74,67.96 R14.1
USBD-
  Top 0.5: X1.2 26.3,69.5 24.78,67.98 R15.1
VCC  (via drill 0.6)  (1 unrouted)
  Top 0.3: R13.2 C11.2 25.86,8.05 v24.18,9.73 | LCD.2 3.88,4.42 4.44,4.99 5.06,4.99 6.25,6.17 6.25,15.8 6.96,16.52 SP1.P$1 | IC2.4 | 18.47,33.24 18.56,33.33 | R22.2 18.57,72.54 18.57,61.78 21.35,59 21.35,52.78 20.68,52.12 18.09,52.12 17.5,51.52 17.5,50.54 R16.2
  Top 0.4: LCD.15 35.73,5.01 34.96,5.78 34.19,5.78 33.33,6.64 33.33,7.71 33.12,7.92 32.13,7.92 R13.2 | SP1.P$1 9.53,22.86 8.7,23.68 R21.2
  Top 0.406: R21.2
  Top 0.5: IC2.4 18.09,32.87 18.47,33.24 19.8,31.91 v19.8,31.4 | 18.56,33.33 IC2.32 18.56,38.44 C14.2 17.56,50.4 R16.2 14.28,50.5
  Bottom 0.3: SV1.2 27.78,23.28 | 8.81,21.13 8.66,20.98 | 8.66,16.34 SP1.P$1 | 21.28,21.91 21.39,22.02 | 3.54,31.28 P1.P$3
  Bottom 0.6: 8.81,21.13 9.7,22.02 21.39,22.02 24.27,24.9 26.5,24.9 27.92,23.48 SV1.2 | 8.66,16.34 8.66,20.98 8.66,26.66 | v24.18,9.73 24.18,11.49 21.28,14.39 21.28,21.91 | 8.66,26.66 13.4,31.4 v19.8,31.4 | 8.66,26.66 4.24,31.08 P1.P$3
VUSB  (via drill 0.6)
  Top 0.3: IC2.18 25.62,30.42 24.27,30.42 19.36,35.34 IC2.31 19.3,36.81 19.3,38.7 18.9,39.1 18.9,44 21.49,46.59 24.97,46.59 26.06,47.47 26.08,57.19 27.43,58.69 27.43,62.71 v27.35,62.78
  Top 0.5: R4.1 D1.A 11.58,67.18 v12.24,67.18 | RX1.2 v27.35,62.78
  Bottom 0.5: v27.35,62.78 27.35,63.42 24.8,65.97 17.06,65.97 17.04,65.95 13.47,65.95 v12.24,67.18

### Text on the board
tPlace: +500V | + | Henrik Forstén | 1305